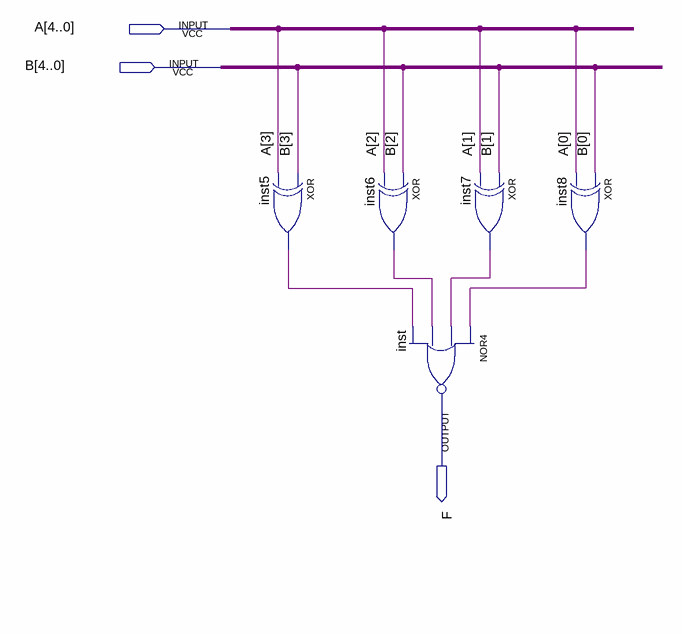
[diagram p0: schematic sheet]
// Quartus schematic Comparador_Palavra.bdf as structural Verilog: 5 symbols, 3 pins
module Comparador_Palavra (
  input  [4:0] A,
  input  [4:0] B,
  output F
);

  wire inst5_out, inst6_out, inst7_out, inst8_out;

  xor inst5 (inst5_out, B[3], A[3]);
  xor inst6 (inst6_out, B[2], A[2]);
  nor inst (F, inst8_out, inst7_out, inst6_out, inst5_out);
  xor inst7 (inst7_out, B[1], A[1]);
  xor inst8 (inst8_out, B[0], A[0]);
endmodule
